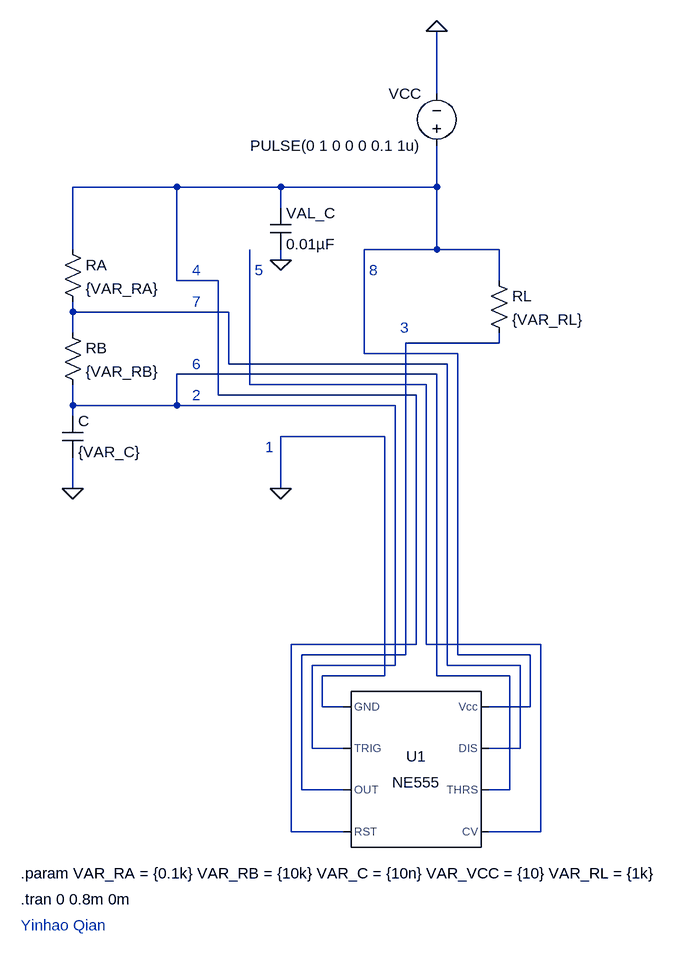
[diagram p0: schematic Draft1.asc]
Draft1.asc, the LTspice schematic file:
Version 4
SHEET 1 1764 1072
WIRE 240 -224 240 -320
WIRE -160 -80 -320 -80
WIRE 0 -80 -160 -80
WIRE 240 -80 240 -144
WIRE 240 -80 0 -80
WIRE 0 -48 0 -80
WIRE -320 16 -320 -80
WIRE 240 16 240 -80
WIRE 240 16 128 16
WIRE 336 16 240 16
WIRE 0 32 0 16
WIRE -160 64 -160 -80
WIRE -96 64 -160 64
WIRE 336 64 336 16
WIRE -320 112 -320 96
WIRE -80 112 -320 112
WIRE -320 144 -320 112
WIRE 336 160 336 144
WIRE 336 160 192 160
WIRE 128 176 128 16
WIRE 272 176 128 176
WIRE -80 192 -80 112
WIRE 256 192 -80 192
WIRE 240 208 -160 208
WIRE -48 224 -48 16
WIRE 224 224 -48 224
WIRE -96 240 -96 64
WIRE 208 240 -96 240
WIRE -320 256 -320 224
WIRE -160 256 -160 208
WIRE -160 256 -320 256
WIRE 176 256 -160 256
WIRE -320 272 -320 256
WIRE 160 304 0 304
WIRE -320 384 -320 336
WIRE 0 384 0 304
WIRE 208 624 208 240
WIRE 208 624 16 624
WIRE 224 624 224 224
WIRE 400 624 224 624
WIRE 192 640 192 160
WIRE 192 640 32 640
WIRE 272 640 272 176
WIRE 384 640 272 640
WIRE 176 656 176 256
WIRE 176 656 48 656
WIRE 256 656 256 192
WIRE 368 656 256 656
WIRE 160 672 160 304
WIRE 160 672 64 672
WIRE 240 672 240 208
WIRE 352 672 240 672
WIRE 64 720 64 672
WIRE 96 720 64 720
WIRE 384 720 384 640
WIRE 384 720 320 720
WIRE 48 784 48 656
WIRE 96 784 48 784
WIRE 368 784 368 656
WIRE 368 784 320 784
WIRE 32 848 32 640
WIRE 96 848 32 848
WIRE 352 848 352 672
WIRE 352 848 320 848
WIRE 16 912 16 624
WIRE 96 912 16 912
WIRE 400 912 400 624
WIRE 400 912 320 912
FLAG -320 384 0
FLAG 0 384 0
FLAG 240 -320 0
FLAG 0 32 0
SYMBOL Misc\\NE555 208 816 R0
SYMATTR InstName U1
SYMBOL res -336 0 R0
SYMATTR InstName RA
SYMATTR Value {VAR_RA}
SYMBOL res -336 128 R0
SYMATTR InstName RB
SYMATTR Value {VAR_RB}
SYMBOL cap -336 272 R0
SYMATTR InstName C
SYMATTR Value {VAR_C}
SYMBOL cap -16 -48 R0
SYMATTR InstName VAL_C
SYMATTR Value 0.01µF
SYMBOL voltage 240 -128 R180
WINDOW 0 24 96 Left 2
WINDOW 3 24 16 Left 2
WINDOW 123 0 0 Left 0
WINDOW 39 0 0 Left 0
SYMATTR InstName VCC
SYMATTR Value PULSE(0 1 0 0 0 0.1 1u)
SYMBOL res 320 48 R0
SYMATTR InstName RL
SYMATTR Value {VAR_RL}
TEXT -136 48 Left 2 ;4
TEXT -136 96 Left 2 ;7
TEXT -136 192 Left 2 ;6
TEXT -136 240 Left 2 ;2
TEXT -40 48 Left 2 ;5
TEXT 136 48 Left 2 ;8
TEXT 184 136 Left 2 ;3
TEXT -24 320 Left 2 ;1
TEXT -400 976 Left 2 !.param VAR_RA = {0.1k} VAR_RB = {10k} VAR_C = {10n} VAR_VCC = {10} VAR_RL = {1k}
TEXT -400 1016 Left 2 !.tran 0 0.8m 0m
TEXT -400 1056 Left 2 ;Yinhao Qian

The netlist it stands for:
* Draft1.asc
XU1 0 N004 N003 N001 N005 N004 N002 N001 NE555  ; pins GND TRIG OUT RST CV THRS DIS Vcc
RA N001 N002 {VAR_RA}
RB N002 N004 {VAR_RB}
C N004 0 {VAR_C}
C§VAL_C N001 0 0.01µF
VCC N001 0 PULSE(0 1 0 0 0 0.1 1u)
RL N001 N003 {VAR_RL}
* 4
* 7
* 6
* 2
* 5
* 8
* 3
* 1
.param VAR_RA = {0.1k} VAR_RB = {10k} VAR_C = {10n} VAR_VCC = {10} VAR_RL = {1k}
.tran 0 0.8m 0m
* Yinhao Qian
.lib NE555.sub
.backanno
.end